# EAGLE design encoder counter (EAGLE 9.1.0)
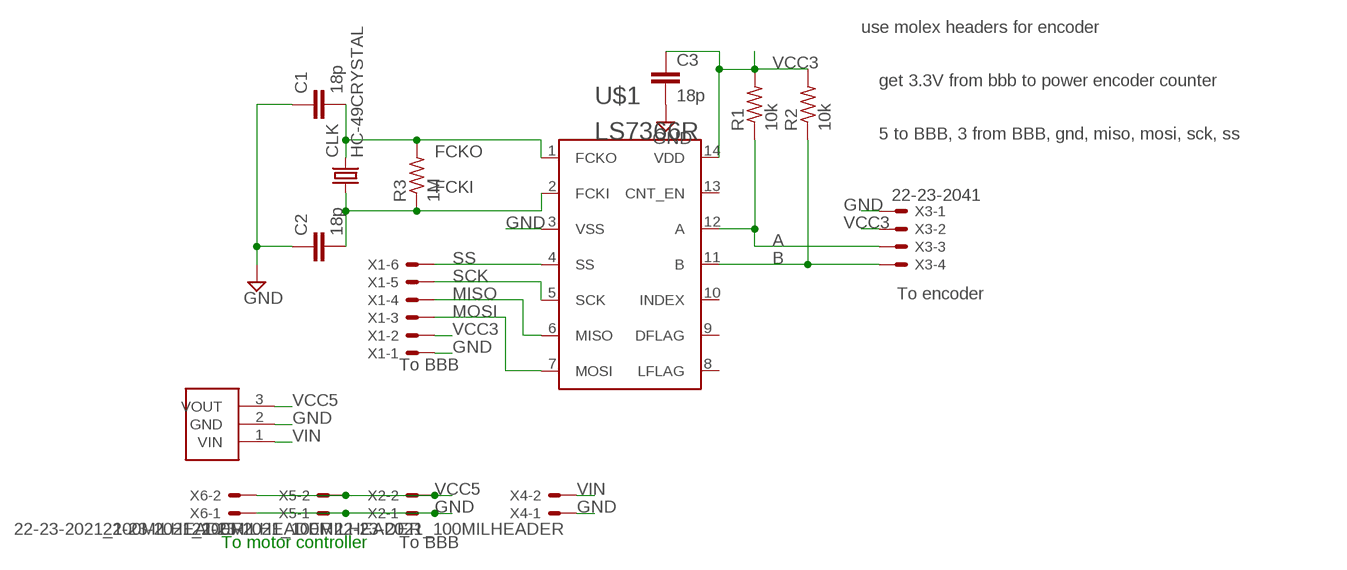
[diagram p0: schematic, sheet 1]

## Parts
C1  18p  C-EUC1206  [C1206]
C2  18p  C-EUC1206  [C1206]
C3  18p  C-EUC1206  [C1206]
CLK  HC-49CRYSTAL  [HC49/S]
R1  10k  R-US_R1206  [R1206]
R2  10k  R-US_R1206  [R1206]
R3  1M  R-US_R1206  [R1206]
U$1  LS7366R  [SO14]
U$3  OKI-78SR-X_3PIN-DCDC  [MA03-1]
X1  22-23-2061  [22-23-2061]
X2  22-23-2021_100MILHEADER  [22-23-2021_199MILHEADER]
X3  22-23-2041  [22-23-2041]
X4  22-23-2021_100MILHEADER  [22-23-2021_199MILHEADER]
X5  22-23-2021_100MILHEADER  [22-23-2021_199MILHEADER]
X6  22-23-2021_100MILHEADER  [22-23-2021_199MILHEADER]

## Nets
A: R1.1 U$1.12(A) X3.3
B: R2.1 U$1.11(B) X3.4
FCKI: C2.2 CLK.1 R3.1 U$1.2(FCKI)
FCKO: C1.2 CLK.2 R3.2 U$1.1(FCKO)
GND: C1.1 C2.1 C3.2 U$1.3(VSS) U$3.2(GND) X1.1 X2.1 X3.1 X4.1 X5.1 X6.1
MISO: U$1.6(MISO) X1.4
MOSI: U$1.7(MOSI) X1.3
SCK: U$1.5(SCK) X1.5
SS: U$1.4(SS) X1.6
VCC3: C3.1 R1.2 R2.2 U$1.14(VDD) X1.2 X3.2
VCC5: U$3.3(VOUT) X2.2 X5.2 X6.2
VIN: U$3.1(VIN) X4.2
Unconnected: U$1.8(LFLAG) U$1.9(DFLAG) U$1.10(INDEX) U$1.13(CNT_EN)

## Notes on the sheet
- use molex headers for encoder
- get 3.3V from bbb to power encoder counter
- 5 to BBB, 3 from BBB, gnd, miso, mosi, sck, ss
- To encoder
- To BBB
- To motor controller | To BBB

## Library data of the parts
C1-C3 = rcl:C-EU: CAPACITOR, European symbol; SPICEPREFIX: C
CLK = HuskyRobotics17-18:HC-49CRYSTAL
R1-R3 = rcl:R-US_: RESISTOR, American symbol; SPICEPREFIX: R
U$1 = HuskyRobotics17-18:LS7366R
U$3 = HuskyRobotics17-18:OKI-78SR-X_3PIN-DCDC
X1 = HuskyRobotics17-18:22-23-2061: .100" (2.54mm) Center Header - 6 Pin; MF: MOLEX; MPN: 22-23-2061; OC_FARNELL: 1462922; OC_NEWARK: 27C1933
X2 X4-X6 = HuskyRobotics17-18:22-23-2021_100MILHEADER: .100" (2.54mm) Center Header - 2 Pin; MF: MOLEX; MPN: 22-23-2021; OC_FARNELL: 1462926; OC_NEWARK: 25C3832
X3 = HuskyRobotics17-18:22-23-2041: .100" (2.54mm) Center Header - 4 Pin; MF: MOLEX; MPN: 22-23-2041; OC_FARNELL: 1462920; OC_NEWARK: 38C0355

## Board
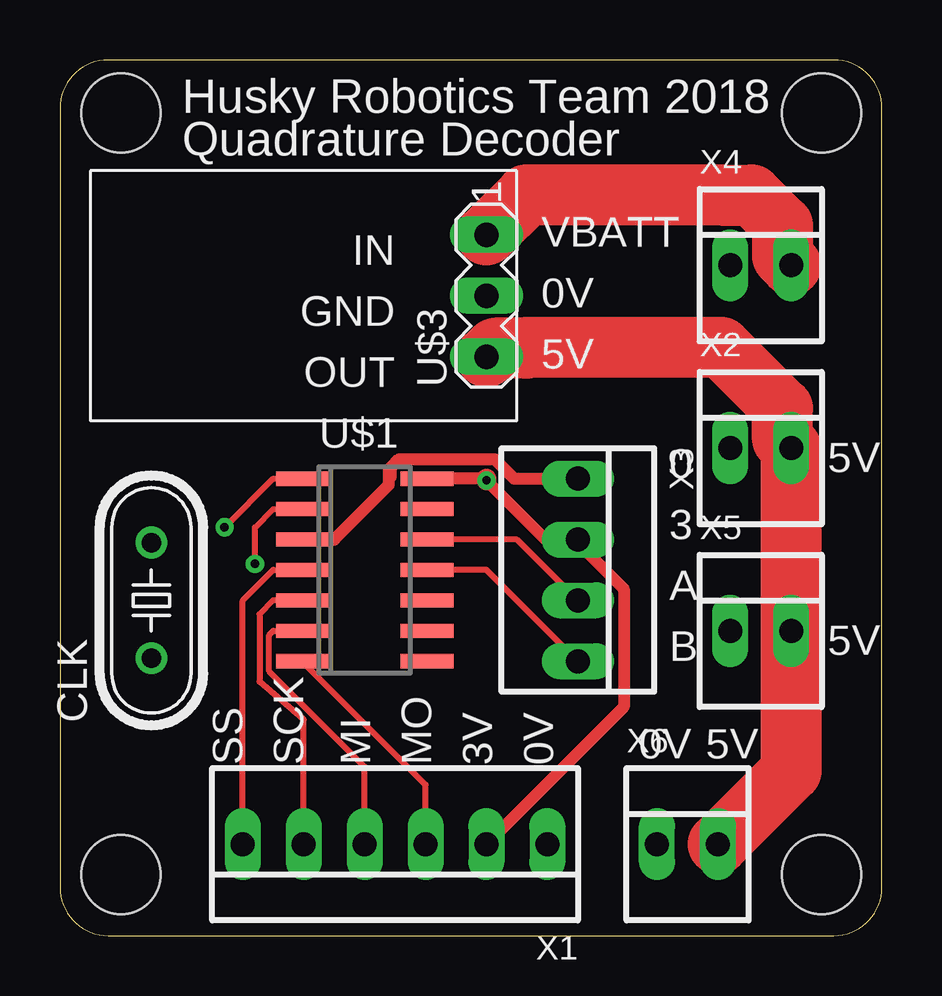
[diagram p1: board, top side]
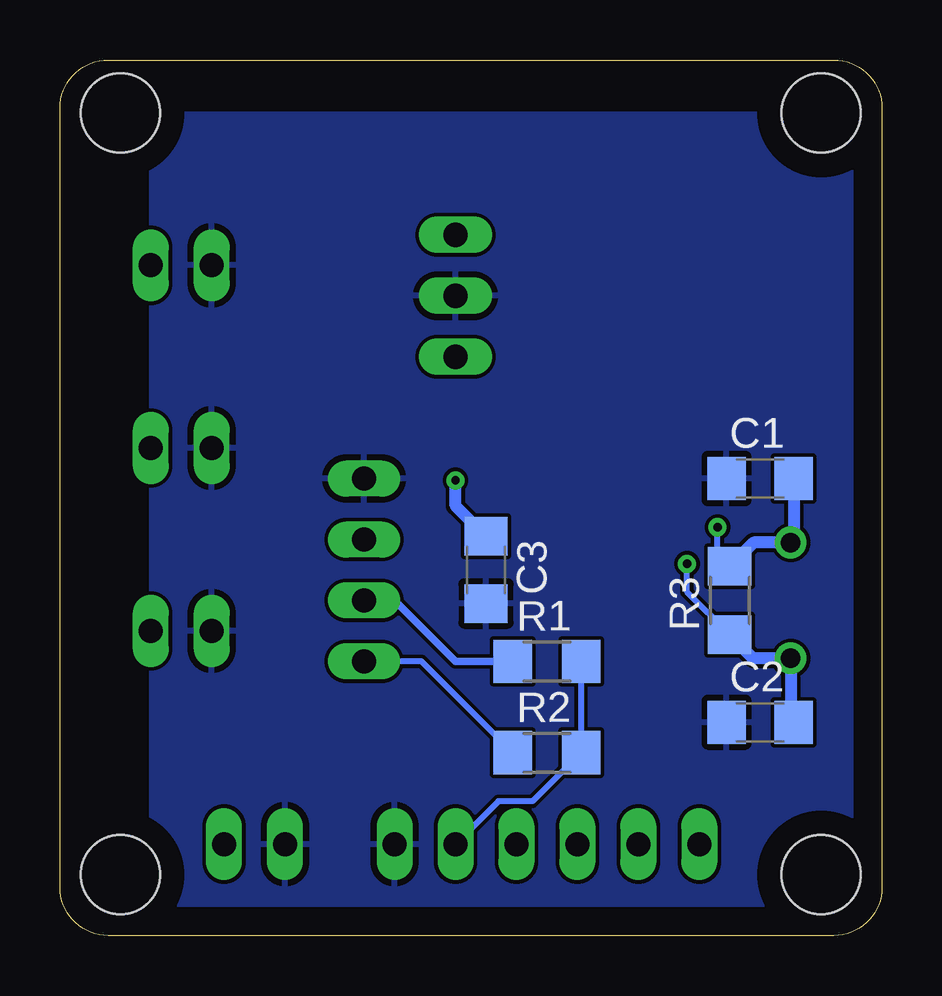
[diagram p2: board, bottom side, seen from below]

Size 34.27 x 36.5 mm. Coordinates in mm from the lower left corner, seen from the top.
Outline: 0,34.5 0,2 arc90 2,0 32.27,0 arc90 34.27,2 34.27,34.5 arc90 32.27,36.5 2,36.5 arc90 0,34.5
Copper layers (1*16): Top 0.035mm / dielectric 1.5mm / Bottom 0.035mm
Design rules "default": minimum track width 6mil, minimum drill 0.35mm, track to track 6mil, track to pad 6mil, pad to pad 6mil, via to via 6mil, smd to smd 6mil, copper to edge 40mil, drill to drill 6mil, minimum pad ring 10mil, minimum via ring 8mil, stop-mask expansion 4mil, vias tented up to drill 0mil, thermal gap 10mil
Holes 3.3 mm at 2.54,34.29 31.75,34.29 2.54,2.54 31.75,2.54

### Footprints (pad centres in the part's own frame; a part is rotated, then mirrored left to right if it is on the bottom)
C1206 = smd 1.6 x 1.8: 1 -1.4,0; 2 1.4,0
HC49/S = drill 0.813: 1 -2.413,0; 2 2.413,0
R1206 = smd 1.6 x 1.803: 1 -1.422,0; 2 1.422,0
SO14 = smd 0.6 x 2.2: 1 -3.81,-2.6; 2 -2.54,-2.6; 3 -1.27,-2.6; 4 0,-2.6; 5 1.27,-2.6; 6 2.54,-2.6; 7 3.81,-2.6; 8 3.81,2.6; 9 2.54,2.6; 10 1.27,2.6; 11 0,2.6; 12 -1.27,2.6; 13 -2.54,2.6; 14 -3.81,2.6
MA03-1 = drill 1.016 long: 1 2.54,0; 2 0,0; 3 -2.54,0
22-23-2061 = drill 1 long: 1 -6.35,0; 2 -3.81,0; 3 -1.27,0; 4 1.27,0; 5 3.81,0; 6 6.35,0
22-23-2021_199MILHEADER = drill 1 long: 1 -1.27,0; 2 1.27,0
22-23-2041 = drill 1 long: 1 -3.81,0; 2 -1.27,0; 3 1.27,0; 4 3.81,0

### Placement (x,y rotation side)
C1  5.08,19.05 0 bottom
C2  5.08,8.89 0 bottom
C3  16.51,15.24 270 bottom
CLK  3.81,13.97 90 top
R1  13.97,11.43 0 bottom
R2  13.97,7.62 0 bottom
R3  6.35,13.97 90 bottom
U$1  12.7,15.24 270 top
U$3  17.78,26.67 90 top
X1  13.97,3.81 180 top
X2  29.21,20.32 0 top
X3  21.59,15.24 270 top
X4  29.21,27.94 0 top
X5  29.21,12.7 0 top
X6  26.16,3.81 0 top

### Tracks (layer width: path | path; a pad name or v marks a point on that pad's centre or on a via)
A
  Top 0.254: X3.3 19.05,16.51 U$1.12
  Bottom 0.305: R1.1 17.78,11.43 20.32,13.97 X3.3
B
  Top 0.254: X3.4 17.78,15.24 U$1.11
  Bottom 0.254: R2.1 19.2,11.43 X3.4
FCKI  (via drill 0.35)
  Top 0.254: v8.13,15.49 8.13,17.02 8.89,17.78 U$1.2
  Bottom 0.254: R3.1 8.13,14.33 v8.13,15.49
  Bottom 0.508: R3.1 5.36,11.56 CLK.1 3.81,9.02 C2.2
FCKO  (via drill 0.35)
  Top 0.254: v6.86,17.02 8.89,19.05 U$1.1
  Bottom 0.254: R3.2 6.86,15.9 v6.86,17.02
  Bottom 0.508: R3.2 5.36,16.38 CLK.2 3.68,16.51 C1.2
GND
  Top 0.508: U$1.3 11.43,16.51 13.72,18.8 13.72,19.05 | 13.72,19.05 13.72,19.44 | 13.72,19.05 13.79,19.13 13.79,19.52 14.14,19.86 18.12,19.86 18.93,19.05 X3.1
  pour Bottom: 1.27,34.29 1.27,1.27 30.48,1.27 30.48,34.29
MISO
  Top 0.254: X1.4 12.7,7.04 8.72,11.01 8.72,12.53 8.89,12.7 U$1.6
MOSI
  Top 0.254: X1.3 15.24,6.29 U$1.7
SCK
  Top 0.254: 10.16,13.91 U$1.5 8.89,13.97 8.31,13.39 8.31,10.59 10.16,9 X1.5
SS
  Top 0.254: X1.6 7.62,13.97 8.89,15.24 U$1.4
VCC3  (via drill 0.35)
  Top 0.508: 17.78,19.05 U$1.14 | v17.78,18.97 20.24,16.51 X3.2 21.59,16.36 23.5,14.45 23.5,9.53 X1.2
  Top 0.813: v17.78,18.97 17.78,19.05
  Bottom 0.254: R1.2 R2.2 14.57,5.6 15.99,5.6 X1.2
  Bottom 0.508: C3.1 17.78,17.91 v17.78,18.97
VCC5
  Top 2.54: X6.2 30.48,6.86 X5.2 X2.2 30.12,20.68 30.12,21.98 27.57,24.52 19.48,24.52 19.45,24.49 18.14,24.49 U$3.3
VIN
  Top 2.54: 27.55,30.87 | 27.55,30.87 28.84,30.87 30.12,29.6 30.12,28.3 X4.2 | 27.55,30.87 19.44,30.87 U$3.1

### Text on the board
tPlace: Husky Robotics Team 2018 | Quadrature Decoder | VBATT | 0V | 5V | 0 | 5V | 3 | A | 5V | B | SS | SCK | MI | MO | 3V | 0V | 0V | 5V